# EAGLE design Breakout (EAGLE 7.1.0)
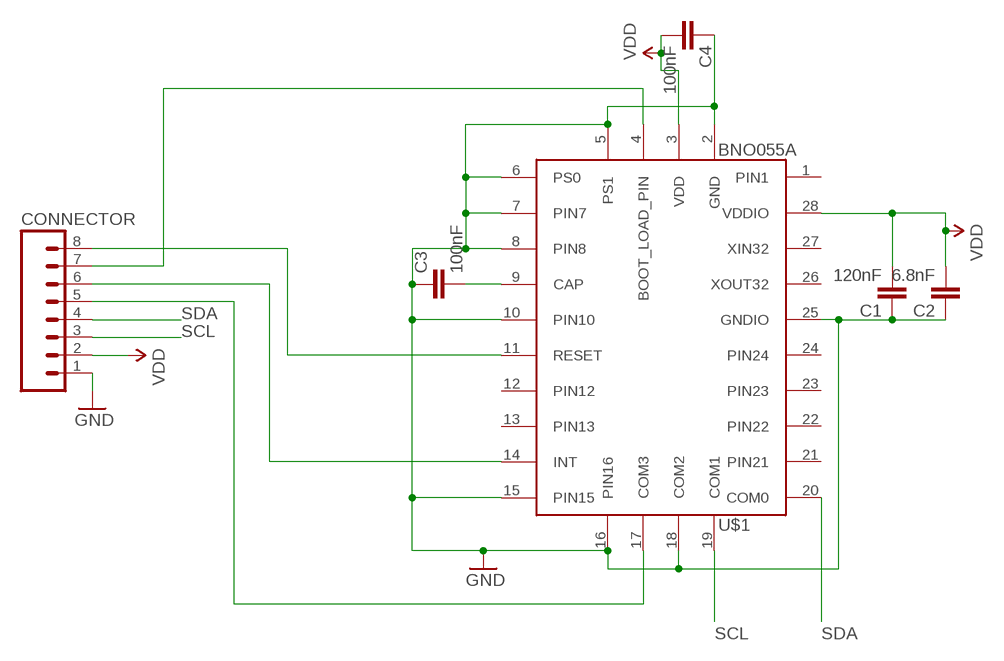
[diagram p0: schematic, sheet 1]

## Parts
C1  120nF  CAP1206  [1206]
C2  6.8nF  CAP1206  [1206]
C3  100nF  CAP1206  [1206]
C4  100nF  CAP1206  [1206]
CONNECTOR  M08NO_SILK  [1X08_NO_SILK]
U$1  BNO055A  [BNO055]

## Nets
GND: C1.1 C2.1 C3.1 C4.1 CONNECTOR.1 U$1.2(GND) U$1.5(PS1) U$1.6(PS0) U$1.7(PIN7) U$1.8(PIN8) U$1.10(PIN10) U$1.15(PIN15) U$1.16(PIN16) U$1.18(COM2) U$1.25(GNDIO)
N$1: CONNECTOR.8 U$1.11(RESET)
N$2: C3.2 U$1.9(CAP)
N$6: CONNECTOR.7 U$1.4(BOOT_LOAD_PIN)
N$7: CONNECTOR.6 U$1.14(INT)
N$8: CONNECTOR.5 U$1.17(COM3)
SCL: CONNECTOR.3 U$1.19(COM1)
SDA: CONNECTOR.4 U$1.20(COM0)
VDD: C1.2 C2.2 C4.2 CONNECTOR.2 U$1.3(VDD) U$1.28(VDDIO)
Unconnected: U$1.1(PIN1) U$1.12(PIN12) U$1.13(PIN13) U$1.21(PIN21) U$1.22(PIN22) U$1.23(PIN23) U$1.24(PIN24) U$1.26(XOUT32) U$1.27(XIN32)

## Library data of the parts
C1-C4 = SparkFun-Capacitors:CAP: Capacitor Standard 0603 ceramic capacitor, and 0.1" leaded capacitor.
CONNECTOR = SparkFun-Connectors:M08: Header 8 Standard 8-pin 0.1" header. Use with straight break away headers (SKU : PRT-00116), right angle break away headers (PRT-00553), swiss pins (PRT-00743), machine pins (PRT-00117), and female headers (PRT-00115).
U$1 = BNO055:BNO055

## Board
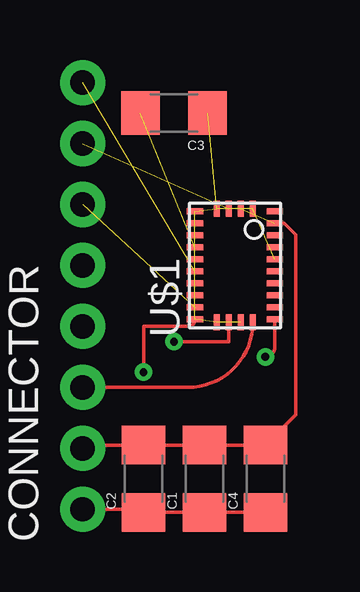
[diagram p1: board, top side]
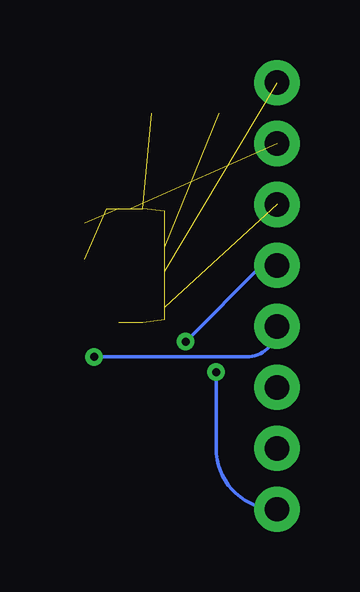
[diagram p2: board, bottom side, seen from below]

No outline drawn. Coordinates in mm, seen from the top.
Copper layers (1*16): Top 0.035mm / dielectric 1.5mm / Bottom 0.035mm
Design rules "default": minimum track width 10mil, minimum drill 24mil, track to track 8mil, track to pad 8mil, pad to pad 8mil, via to via 8mil, smd to smd 8mil, copper to edge 40mil, drill to drill 8mil, minimum pad ring 10mil, minimum via ring 8mil, stop-mask expansion 4mil, vias tented up to drill 0mil, thermal gap 10mil

### Footprints (pad centres in the part's own frame; a part is rotated, then mirrored left to right if it is on the bottom)
1206 = smd 1.6 x 1.8: 1 -1.4,0; 2 1.4,0
1X08_NO_SILK = drill 1.016 pad 1.88: 1 0,0; 2 2.54,0; 3 5.08,0; 4 7.62,0; 5 10.16,0; 6 12.7,0; 7 15.24,0; 8 17.78,0
BNO055 = smd 0.675 x 0.25: 1 1.663,2.25; 6 -1.665,2.25; 7 -1.665,1.75; 8 -1.665,1.25; 9 -1.665,0.75; 10 -1.665,0.25; 11 -1.665,-0.25; 12 -1.665,-0.75; 13 -1.665,-1.25; 14 -1.665,-1.75; 15 -1.665,-2.25; 20 1.663,-2.25; 21 1.663,-1.75; 22 1.663,-1.25; 23 1.663,-0.75; 24 1.663,-0.25; 25 1.663,0.25; 26 1.663,0.75; 27 1.663,1.25; 28 1.663,1.75 | smd 0.25 x 0.675: 2 0.75,2.362; 3 0.25,2.362; 4 -0.25,2.362; 5 -0.75,2.362; 16 -0.75,-2.362; 17 -0.25,-2.362; 18 0.25,-2.362; 19 0.75,-2.362

### Placement (x,y rotation side)
C1  6.35,2.54 90 top
C2  3.81,2.54 90 top
C3  5.08,17.78 180 top
C4  8.89,2.54 90 top
CONNECTOR  1.27,1.27 90 top
U$1  7.62,11.43 0 top

### Tracks (layer width: path | path; a pad name or v marks a point on that pad's centre or on a via)
GND  (via drill 0.33)  (10 unrouted)
  Top 0.152: CONNECTOR.1 3.81,1.27 C2.1 C1.1 C4.1 | U$1.15 arc-90 5.67,8.89 3.81,8.89 v3.81,6.99
  Bottom 0.152: v3.81,6.99 3.81,3.81 arc-90 CONNECTOR.1
N$1  (1 unrouted)
N$2  (1 unrouted)
N$6  (1 unrouted)
N$7  (1 unrouted)
N$8  (via drill 0.33)
  Top 0.152: v5.08,8.26 7.37,8.26 U$1.17
  Bottom 0.152: CONNECTOR.5 1.91,11.43 v5.08,8.26
SCL
  Top 0.152: CONNECTOR.3 5.65,6.35 arc90 U$1.19
SDA  (via drill 0.33)
  Top 0.152: v8.89,7.62 arc90 9.28,8.01 U$1.20
  Bottom 0.152: CONNECTOR.4 arc90 2.54,7.62 v8.89,7.62
VDD  (1 unrouted)
  Top 0.152: CONNECTOR.2 1.4,3.94 C2.2 3.81,3.81 3.94,3.94 C1.2 C4.2 10.16,5.21 10.16,12.7 9.68,13.18 U$1.28